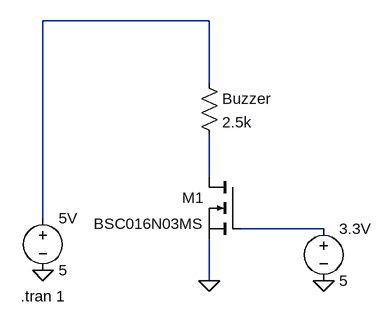
[diagram p0: schematic Buzzer.asc]
Buzzer.asc, the LTspice schematic file:
Version 4
SHEET 1 880 680
WIRE 240 -160 -16 -160
WIRE 240 -64 240 -160
WIRE 240 80 240 16
WIRE -16 144 -16 -160
WIRE 416 160 288 160
WIRE 240 240 240 176
FLAG 240 240 0
FLAG -16 224 0
FLAG 416 240 0
SYMBOL voltage -16 128 R0
WINDOW 123 0 0 Left 0
WINDOW 39 0 0 Left 0
SYMATTR InstName 5V
SYMATTR Value 5
SYMBOL res 224 -80 R0
SYMATTR InstName Buzzer
SYMATTR Value 2.5k
SYMBOL nmos 288 80 M0
SYMATTR InstName M1
SYMATTR Value BSC016N03MS
SYMBOL voltage 416 144 R0
SYMATTR InstName 3.3V
SYMATTR Value 5
TEXT -50 264 Left 2 !.tran 1

The netlist it stands for:
* Buzzer.asc
V§5V N001 0 5
R§Buzzer N001 N002 2.5k
M1 N002 N003 0 0 BSC016N03MS
V§3.3V N003 0 5
.model NMOS NMOS
.model PMOS PMOS
.lib standard.mos
.tran 1
.backanno
.end